# EAGLE design RGB_ADDR_THRU (EAGLE 7.2.0)
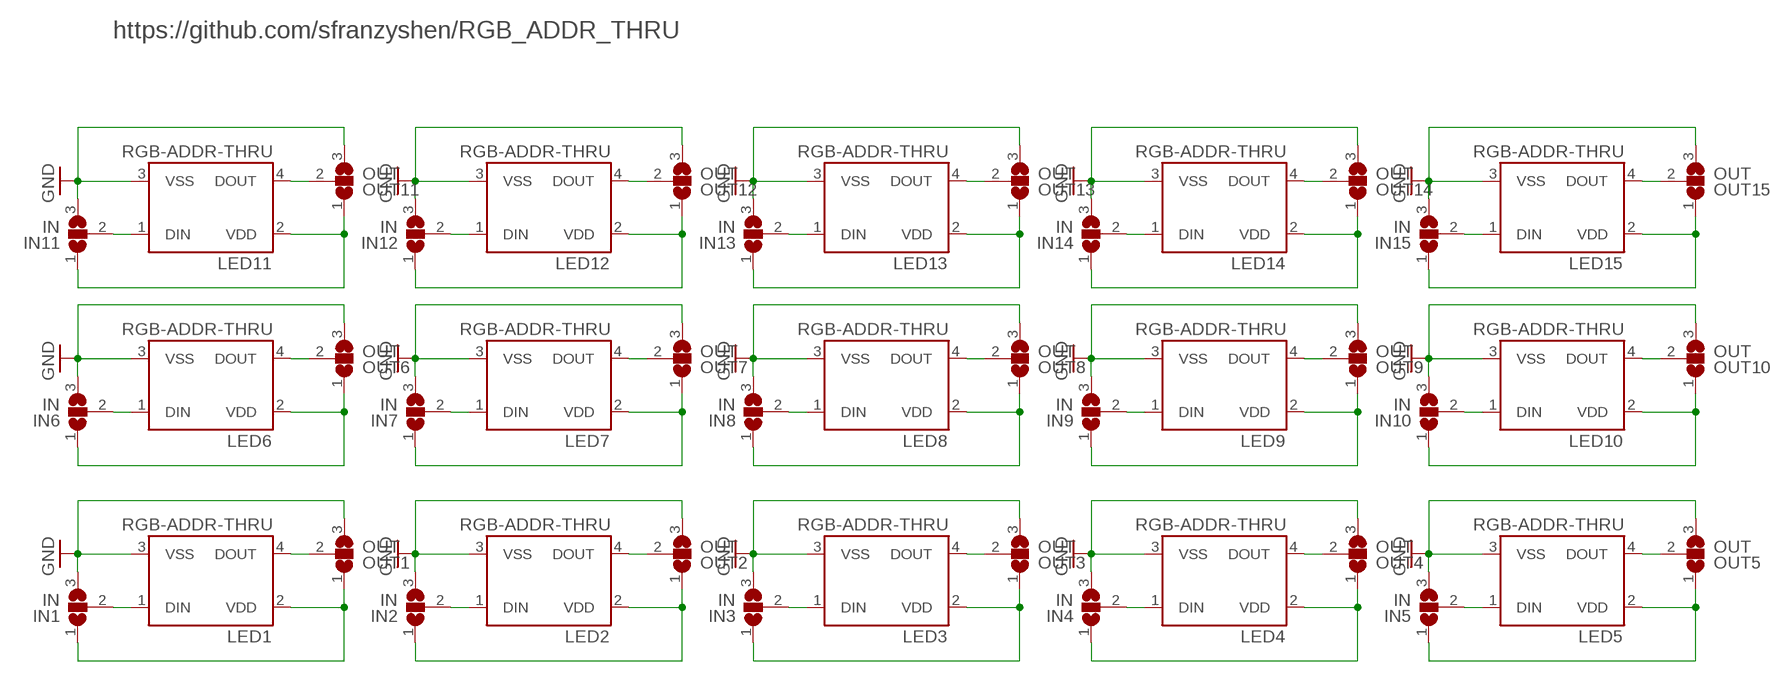
[diagram p0: schematic, sheet 1]

## Parts
IN1  IN  SJ2WW  [SJ_2W]
IN2  IN  SJ2WW  [SJ_2W]
IN3  IN  SJ2WW  [SJ_2W]
IN4  IN  SJ2WW  [SJ_2W]
IN5  IN  SJ2WW  [SJ_2W]
IN6  IN  SJ2WW  [SJ_2W]
IN7  IN  SJ2WW  [SJ_2W]
IN8  IN  SJ2WW  [SJ_2W]
IN9  IN  SJ2WW  [SJ_2W]
IN10  IN  SJ2WW  [SJ_2W]
IN11  IN  SJ2WW  [SJ_2W]
IN12  IN  SJ2WW  [SJ_2W]
IN13  IN  SJ2WW  [SJ_2W]
IN14  IN  SJ2WW  [SJ_2W]
IN15  IN  SJ2WW  [SJ_2W]
LED1  RGB-ADDR-THRU  LED-RGB-ADDR-THRU5MM  [LED-RGB-THRU]
LED2  RGB-ADDR-THRU  LED-RGB-ADDR-THRU5MM  [LED-RGB-THRU]
LED3  RGB-ADDR-THRU  LED-RGB-ADDR-THRU5MM  [LED-RGB-THRU]
LED4  RGB-ADDR-THRU  LED-RGB-ADDR-THRU5MM  [LED-RGB-THRU]
LED5  RGB-ADDR-THRU  LED-RGB-ADDR-THRU5MM  [LED-RGB-THRU]
LED6  RGB-ADDR-THRU  LED-RGB-ADDR-THRU5MM  [LED-RGB-THRU]
LED7  RGB-ADDR-THRU  LED-RGB-ADDR-THRU5MM  [LED-RGB-THRU]
LED8  RGB-ADDR-THRU  LED-RGB-ADDR-THRU5MM  [LED-RGB-THRU]
LED9  RGB-ADDR-THRU  LED-RGB-ADDR-THRU5MM  [LED-RGB-THRU]
LED10  RGB-ADDR-THRU  LED-RGB-ADDR-THRU5MM  [LED-RGB-THRU]
LED11  RGB-ADDR-THRU  LED-RGB-ADDR-THRU5MM  [LED-RGB-THRU]
LED12  RGB-ADDR-THRU  LED-RGB-ADDR-THRU5MM  [LED-RGB-THRU]
LED13  RGB-ADDR-THRU  LED-RGB-ADDR-THRU5MM  [LED-RGB-THRU]
LED14  RGB-ADDR-THRU  LED-RGB-ADDR-THRU5MM  [LED-RGB-THRU]
LED15  RGB-ADDR-THRU  LED-RGB-ADDR-THRU5MM  [LED-RGB-THRU]
OUT1  OUT  SJ2WW  [SJ_2W]
OUT2  OUT  SJ2WW  [SJ_2W]
OUT3  OUT  SJ2WW  [SJ_2W]
OUT4  OUT  SJ2WW  [SJ_2W]
OUT5  OUT  SJ2WW  [SJ_2W]
OUT6  OUT  SJ2WW  [SJ_2W]
OUT7  OUT  SJ2WW  [SJ_2W]
OUT8  OUT  SJ2WW  [SJ_2W]
OUT9  OUT  SJ2WW  [SJ_2W]
OUT10  OUT  SJ2WW  [SJ_2W]
OUT11  OUT  SJ2WW  [SJ_2W]
OUT12  OUT  SJ2WW  [SJ_2W]
OUT13  OUT  SJ2WW  [SJ_2W]
OUT14  OUT  SJ2WW  [SJ_2W]
OUT15  OUT  SJ2WW  [SJ_2W]

## Nets
GND: IN1.3 IN2.3 IN3.3 IN4.3 IN5.3 IN6.3 IN7.3 IN8.3 IN9.3 IN10.3 IN11.3 IN12.3 IN13.3 IN14.3 IN15.3 LED1.3(VSS) LED2.3(VSS) LED3.3(VSS) LED4.3(VSS) LED5.3(VSS) LED6.3(VSS) LED7.3(VSS) LED8.3(VSS) LED9.3(VSS) LED10.3(VSS) LED11.3(VSS) LED12.3(VSS) LED13.3(VSS) LED14.3(VSS) LED15.3(VSS) OUT1.3 OUT2.3 OUT3.3 OUT4.3 OUT5.3 OUT6.3 OUT7.3 OUT8.3 OUT9.3 OUT10.3 OUT11.3 OUT12.3 OUT13.3 OUT14.3 OUT15.3
N$2: IN1.2 LED1.1(DIN)
N$3: IN1.1 LED1.2(VDD) OUT1.1
N$4: LED1.4(DOUT) OUT1.2
N$6: IN2.2 LED2.1(DIN)
N$7: IN2.1 LED2.2(VDD) OUT2.1
N$8: LED2.4(DOUT) OUT2.2
N$10: IN7.2 LED7.1(DIN)
N$11: IN7.1 LED7.2(VDD) OUT7.1
N$12: LED7.4(DOUT) OUT7.2
N$14: IN8.2 LED8.1(DIN)
N$15: IN8.1 LED8.2(VDD) OUT8.1
N$16: LED8.4(DOUT) OUT8.2
N$18: IN9.2 LED9.1(DIN)
N$19: IN9.1 LED9.2(VDD) OUT9.1
N$20: LED9.4(DOUT) OUT9.2
N$22: IN3.2 LED3.1(DIN)
N$23: IN3.1 LED3.2(VDD) OUT3.1
N$24: LED3.4(DOUT) OUT3.2
N$26: IN10.2 LED10.1(DIN)
N$27: IN10.1 LED10.2(VDD) OUT10.1
N$28: LED10.4(DOUT) OUT10.2
N$30: IN4.2 LED4.1(DIN)
N$31: IN4.1 LED4.2(VDD) OUT4.1
N$32: LED4.4(DOUT) OUT4.2
N$34: IN5.2 LED5.1(DIN)
N$35: IN5.1 LED5.2(VDD) OUT5.1
N$36: LED5.4(DOUT) OUT5.2
N$38: IN6.2 LED6.1(DIN)
N$39: IN6.1 LED6.2(VDD) OUT6.1
N$40: LED6.4(DOUT) OUT6.2
N$42: IN11.2 LED11.1(DIN)
N$43: IN11.1 LED11.2(VDD) OUT11.1
N$44: LED11.4(DOUT) OUT11.2
N$46: IN12.2 LED12.1(DIN)
N$47: IN12.1 LED12.2(VDD) OUT12.1
N$48: LED12.4(DOUT) OUT12.2
N$50: IN13.2 LED13.1(DIN)
N$51: IN13.1 LED13.2(VDD) OUT13.1
N$52: LED13.4(DOUT) OUT13.2
N$54: IN14.2 LED14.1(DIN)
N$55: IN14.1 LED14.2(VDD) OUT14.1
N$56: LED14.4(DOUT) OUT14.2
N$58: IN15.2 LED15.1(DIN)
N$59: IN15.1 LED15.2(VDD) OUT15.1
N$60: LED15.4(DOUT) OUT15.2

## Notes on the sheet
- https://github.com/sfranzyshen/RGB_ADDR_THRU

## Library data of the parts
IN1-IN15 OUT1-OUT15 = jumper:SJ2W: SMD solder JUMPER
LED1-LED15 = SparkFun-LED:LED-RGB-ADDR-THRU: RGB Addressable Through-hole SparkFun store front COM-12986 5mm (diffuse) COM-12999 5mm (clear) COM-12877 8mm (diffuse)

## Board
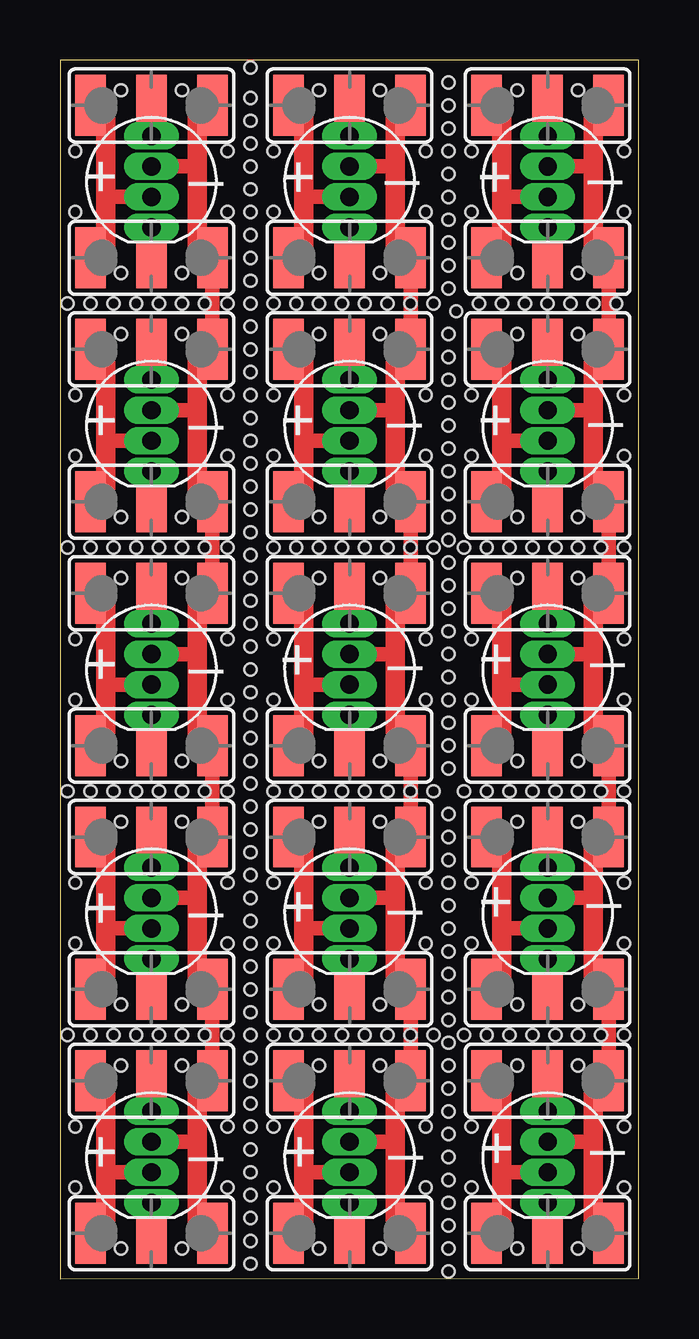
[diagram p1: board, top side]
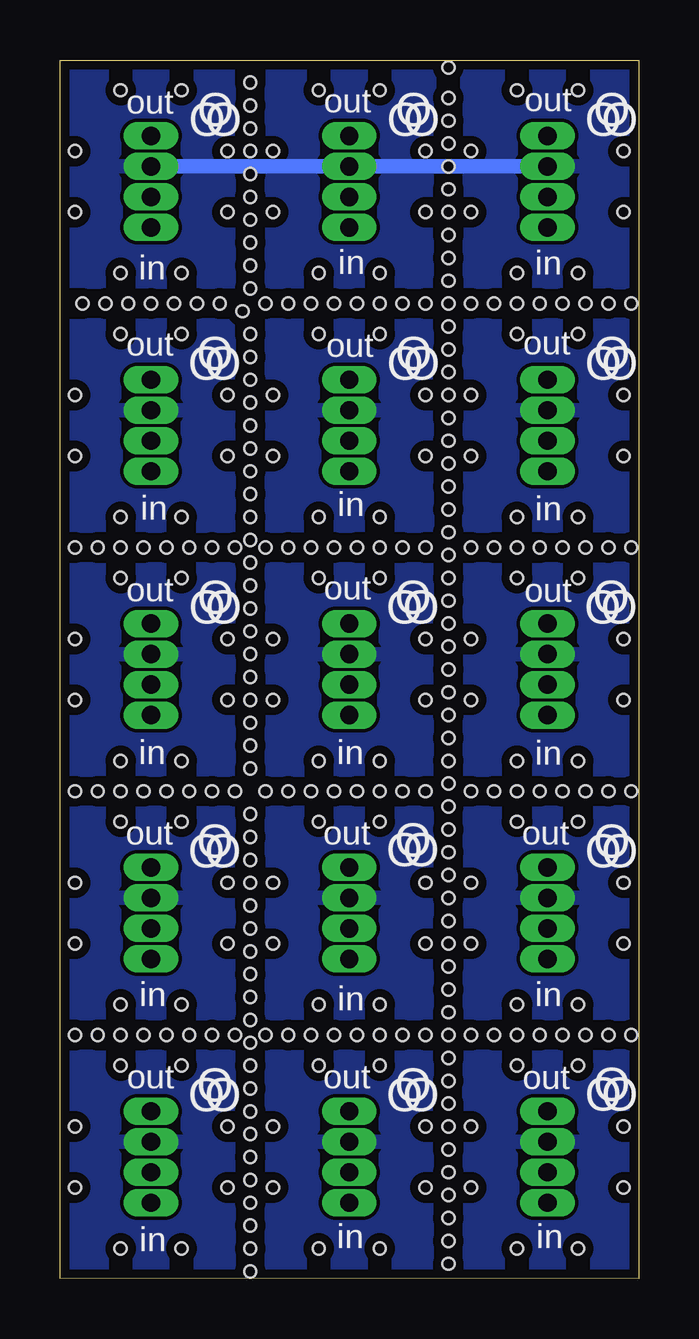
[diagram p2: board, bottom side, seen from below]

Size 24.12 x 50.79 mm. Coordinates in mm from the lower left corner, seen from the top.
Outline: 0,0 24.12,0.03 24.12,50.79 0,50.79 0,0
Copper layers (1*16): Top 0.0356mm / dielectric 1.5011mm / Bottom 0.0356mm
Design rules "LaenPCBOrder": minimum track width 6mil, minimum drill 13mil, track to track 6mil, track to pad 6mil, pad to pad 6mil, via to via 6mil, smd to smd 6mil, copper to edge 15mil, drill to drill 6mil, minimum pad ring 7mil, minimum via ring 7mil, stop-mask expansion 3mil, vias tented up to drill 0mil, thermal gap 10mil
Holes 0.5 mm at 2.54,1.27 5.08,1.27 5.08,8.89 2.54,8.89 0.64,6.35 6.99,6.35 0.64,3.81 6.99,3.81 2.54,19.05 5.08,19.05 2.54,11.43 5.08,11.43 6.99,13.97 6.99,16.51 0.64,16.51 0.64,13.97 2.54,29.21 5.08,29.21 2.54,49.53 5.08,49.53 0.64,26.67 6.99,26.67 6.99,24.13 0.64,24.13 2.54,21.59 5.08,21.59 2.54,41.91 5.08,41.91 6.99,44.45 6.99,46.99 0.64,46.99 0.64,44.45 2.54,39.37 5.08,39.37 2.54,31.75 5.08,31.75 0.64,34.29 0.64,36.83 6.99,36.83 6.99,34.29 10.79,8.89 13.34,8.89 15.24,6.35 15.24,3.81 13.34,1.27 10.79,1.27 8.89,3.81 8.89,6.35 8.89,16.51 10.79,19.05 13.34,19.05 15.24,16.51 15.24,13.97 8.89,13.97 10.79,11.43 13.34,11.43 10.79,21.59 13.34,21.59 8.89,24.13 8.89,26.67 15.24,26.67 15.24,24.13 10.79,29.21 13.34,29.21 10.79,31.75 13.34,31.75 15.24,34.29 8.89,34.29 8.89,36.83 15.24,36.83 13.34,39.37 10.79,39.37 13.34,41.91 10.79,41.91 8.89,44.45 8.89,46.99 15.24,46.99 10.79,49.53 13.34,49.53 15.24,44.45 19.05,1.27 21.59,1.27 23.5,3.81 17.14,3.81 17.14,6.35 23.5,6.35 19.05,8.89 21.59,8.89 19.05,11.43 21.59,11.43 23.5,13.97 17.14,13.97 17.14,16.51 23.5,16.51 19.05,19.05 21.59,19.05 19.05,21.59 21.59,21.59 23.5,24.13 17.14,24.13 17.14,26.67 23.5,26.67 21.59,29.21 19.05,29.21 21.59,31.75 19.05,31.75 17.14,34.29 17.14,36.83 23.5,36.83 23.5,34.29 21.59,39.37 19.05,39.37 21.59,41.91 19.05,41.91 17.14,44.45 17.14,46.99 23.5,46.99 23.5,44.45 21.59,49.53 19.05,49.53 2.22,10.16 3.17,10.16 4.13,10.16 5.08,10.16 6.03,10.16 6.99,10.16 7.94,8.26 7.94,7.3 7.94,6.35 7.94,5.4 7.94,4.45 7.94,3.49 7.94,2.54 7.94,1.59 7.94,17.78 7.94,16.83 7.94,15.88 7.94,14.92 7.94,13.97 7.94,13.02 7.94,12.06 7.94,11.11 2.22,20.32 3.17,20.32 4.13,20.32 5.08,20.32 6.03,20.32 6.99,20.32 7.94,28.26 7.94,27.3 7.94,26.35 7.94,25.4 7.94,24.45 7.94,23.5 7.94,22.54 7.94,21.59 7.94,37.78 7.94,36.83 7.94,35.88 7.94,34.92 7.94,33.97 7.94,33.02 7.94,32.07 7.94,31.11 7.94,48.26 7.94,47.31 7.94,46.35 7.94,45.4 7.94,44.45 7.94,43.5 7.94,42.55 7.94,41.59 0.32,30.48 1.27,30.48 2.22,30.48 3.17,30.48 4.13,30.48 5.08,30.48 0.32,40.64 1.27,40.64 2.22,40.64 3.17,40.64 4.13,40.64 5.08,40.64 7.94,9.21 7.94,10.16 1.27,10.16 0.32,10.16 7.94,18.73 7.94,19.68 7.94,20.64 1.27,20.32 0.32,20.32 6.03,30.48 6.99,30.48 7.94,30.16 7.94,29.21 6.03,40.64 6.99,40.64 7.94,40.64 7.94,38.73 7.94,39.69 7.94,49.21 7.94,50.48 10.79,10.16 11.75,10.16 12.7,10.16 13.65,10.16 14.61,10.16 9.84,10.16 8.89,10.16 10.79,20.32 11.75,20.32 12.7,20.32 13.65,20.32 14.61,20.32 9.84,20.32 8.89,20.32 10.79,30.48 11.75,30.48 12.7,30.48 13.65,30.48 14.61,30.48 9.84,30.48 8.89,30.48 10.79,40.64 11.75,40.64 12.7,40.64 13.65,40.64 14.61,40.64 9.84,40.64 8.89,40.64 16.19,0.32 16.19,1.27 16.19,2.22 16.19,3.17 16.19,4.13 16.19,5.08 16.19,6.03 16.19,6.99 16.19,7.94 16.19,8.89 16.19,9.84 16.19,10.79 16.19,11.75 15.56,10.16 16.83,10.16 17.78,10.16 18.73,10.16 19.68,10.16 20.64,10.16 21.59,10.16 22.54,10.16 23.5,10.16 16.19,12.7 16.19,13.65 16.19,14.61 16.19,15.56 16.19,16.51 16.19,17.46 16.19,18.41 16.19,19.37 15.56,20.32 16.83,20.32 17.78,20.32 18.73,20.32 19.68,20.32 20.64,20.32 21.59,20.32 22.54,20.32 23.5,20.32 16.19,21.27 16.19,22.23 16.19,23.18 16.19,24.13 16.19,25.08 16.19,26.04 16.19,26.99 16.19,27.94 16.19,28.89 16.19,29.84 16.19,30.8 16.19,31.75 15.56,30.48 16.83,30.48 17.78,30.48 18.73,30.48 19.68,30.48 20.64,30.48 21.59,30.48 22.54,30.48 23.5,30.48 15.56,40.64 16.51,40.32 17.46,40.64 18.41,40.64 19.37,40.64 20.32,40.64 21.27,40.64 22.23,40.64 23.18,40.64 16.19,32.7 16.19,33.66 16.19,34.61 16.19,35.56 16.19,36.51 16.19,37.47 16.19,38.42 16.19,39.37 16.19,41.27 16.19,42.23 16.19,43.18 16.19,44.13 16.19,45.09 16.19,46.04 16.19,46.99 16.19,47.94 16.19,48.9 16.19,49.85 7.94,0.64

### Footprints (pad centres in the part's own frame; a part is rotated, then mirrored left to right if it is on the bottom)
SJ_2W = smd 1.27 x 2.54: 1 -2.54,0; 2 0,0; 3 2.54,0
LED-RGB-THRU = drill 0.762 pad 0.889 long: 1 1.905,0; 2 0.635,0; 3 -0.635,0; 4 -1.905,0

### Placement (x,y rotation side)
IN1  3.81,1.91 0 top
IN2  3.81,12.06 0 top
IN3  3.81,22.23 0 top
IN4  3.81,32.38 0 top
IN5  3.81,42.55 0 top
IN6  12.06,1.91 0 top
IN7  12.06,12.06 0 top
IN8  12.06,22.23 0 top
IN9  12.06,32.38 0 top
IN10  12.06,42.55 0 top
IN11  20.32,1.91 0 top
IN12  20.32,12.06 0 top
IN13  20.32,22.23 0 top
IN14  20.32,32.38 0 top
IN15  20.32,42.55 0 top
LED1  3.81,5.08 270 top
LED2  3.81,15.24 270 top
LED3  3.81,25.4 270 top
LED4  3.81,35.56 270 top
LED5  3.81,45.72 270 top
LED6  12.06,5.08 270 top
LED7  12.06,15.24 270 top
LED8  12.06,25.4 270 top
LED9  12.06,35.56 270 top
LED10  12.06,45.72 270 top
LED11  20.32,5.08 270 top
LED12  20.32,15.24 270 top
LED13  20.32,25.4 270 top
LED14  20.32,35.56 270 top
LED15  20.32,45.72 270 top
OUT1  3.81,8.26 0 top
OUT2  3.81,18.41 0 top
OUT3  3.81,28.57 0 top
OUT4  3.81,38.73 0 top
OUT5  3.81,48.9 0 top
OUT6  12.06,8.26 0 top
OUT7  12.06,18.41 0 top
OUT8  12.06,28.57 0 top
OUT9  12.06,38.73 0 top
OUT10  12.06,48.9 0 top
OUT11  20.32,8.26 0 top
OUT12  20.32,18.41 0 top
OUT13  20.32,28.57 0 top
OUT14  20.32,38.73 0 top
OUT15  20.32,48.9 0 top

### Tracks (layer width: path | path; a pad name or v marks a point on that pad's centre or on a via)
GND
  Top 0.61: LED1.3 5.71,5.71 | OUT1.3 IN2.3 | LED2.3 5.71,15.88 | OUT2.3 IN3.3 | LED3.3 5.71,26.04 | OUT3.3 IN4.3 | LED4.3 5.71,36.2 | OUT4.3 IN5.3 | LED5.3 5.71,46.35 | LED6.3 13.97,5.71 | OUT6.3 IN7.3 | LED7.3 13.97,15.88 | OUT7.3 IN8.3 | LED8.3 13.97,26.04 | OUT8.3 IN9.3 | LED9.3 13.97,36.2 | OUT9.3 IN10.3 | LED10.3 13.97,46.35 | LED11.3 22.23,5.71 | OUT11.3 IN12.3 | LED12.3 22.23,15.88 | OUT12.3 IN13.3 | LED13.3 22.23,26.04 | OUT13.3 IN14.3 | LED14.3 22.23,36.2 | OUT14.3 IN15.3 | LED15.3 22.23,46.35
  Top 0.813: IN1.3 arc-90 5.71,2.54 5.71,5.71 5.71,7.62 arc-90 OUT1.3 | IN2.3 arc-90 5.71,12.7 5.71,15.88 5.71,17.78 arc-90 OUT2.3 | IN3.3 arc-90 5.71,22.86 5.71,26.04 5.71,27.94 arc-90 OUT3.3 | IN4.3 arc-90 5.71,33.02 5.71,36.2 5.71,38.1 arc-90 OUT4.3 | IN5.3 arc-90 5.71,43.18 5.71,46.35 5.71,48.26 arc-90 OUT5.3 | IN6.3 arc-90 13.97,2.54 13.97,5.71 13.97,7.62 arc-90 OUT6.3 | IN7.3 arc-90 13.97,12.7 13.97,15.88 13.97,17.78 arc-90 OUT7.3 | IN8.3 arc-90 13.97,22.86 13.97,26.04 13.97,27.94 arc-90 OUT8.3 | IN9.3 arc-90 13.97,33.02 13.97,36.2 13.97,38.1 arc-90 OUT9.3 | IN10.3 arc-90 13.97,43.18 13.97,46.35 13.97,48.26 arc-90 OUT10.3 | IN11.3 arc-90 22.23,2.54 22.23,5.71 22.23,7.62 arc-90 OUT11.3 | IN12.3 arc-90 22.23,12.7 22.23,15.88 22.23,17.78 arc-90 OUT12.3 | IN13.3 arc-90 22.23,22.86 22.23,26.04 22.23,27.94 arc-90 OUT13.3 | IN14.3 arc-90 22.23,33.02 22.23,36.2 22.23,38.1 arc-90 OUT14.3 | IN15.3 arc-90 22.23,43.18 22.23,46.35 22.23,48.26 arc-90 OUT15.3
  Bottom 0.61: LED15.3 LED10.3 LED5.3
  pour Bottom: -0.64,51.44 24.78,51.44 24.78,-0.64 -0.64,-0.64
N$2
  Top 0.61: LED1.1 IN1.2
N$3
  Top 0.61: LED1.2 1.91,4.45
  Top 0.813: IN1.1 arc90 1.91,2.54 1.91,4.45 1.91,7.62 arc90 OUT1.1
N$4
  Top 0.61: LED1.4 OUT1.2
N$6
  Top 0.61: LED2.1 IN2.2
N$7
  Top 0.61: LED2.2 1.91,14.61
  Top 0.813: IN2.1 arc90 1.91,12.7 1.91,14.61 1.91,17.78 arc90 OUT2.1
N$8
  Top 0.61: LED2.4 OUT2.2
N$10
  Top 0.813: LED7.1 IN7.2
N$11
  Top 0.61: LED7.2 10.16,14.61
  Top 0.813: IN7.1 arc90 10.16,12.7 10.16,14.61 10.16,17.78 arc90 OUT7.1
N$12
  Top 0.813: LED7.4 OUT7.2
N$14
  Top 0.813: LED8.1 IN8.2
N$15
  Top 0.61: LED8.2 10.16,24.77
  Top 0.813: IN8.1 arc90 10.16,22.86 10.16,24.77 10.16,27.94 arc90 OUT8.1
N$16
  Top 0.813: LED8.4 OUT8.2
N$18
  Top 0.813: LED9.1 IN9.2
N$19
  Top 0.61: LED9.2 10.16,34.92
  Top 0.813: IN9.1 arc90 10.16,33.02 10.16,34.92 10.16,38.1 arc90 OUT9.1
N$20
  Top 0.813: LED9.4 OUT9.2
N$22
  Top 0.61: LED3.1 IN3.2
N$23
  Top 0.61: LED3.2 1.91,24.77
  Top 0.813: IN3.1 arc90 1.91,22.86 1.91,24.77 1.91,27.94 arc90 OUT3.1
N$24
  Top 0.61: LED3.4 OUT3.2
N$26
  Top 0.813: LED10.1 IN10.2
N$27
  Top 0.61: LED10.2 10.16,45.09
  Top 0.813: IN10.1 arc90 10.16,43.18 10.16,45.09 10.16,48.26 arc90 OUT10.1
N$28
  Top 0.813: LED10.4 OUT10.2
N$30
  Top 0.61: LED4.1 IN4.2
N$31
  Top 0.61: LED4.2 1.91,34.92
  Top 0.813: IN4.1 arc90 1.91,33.02 1.91,34.92 1.91,38.1 arc90 OUT4.1
N$32
  Top 0.61: LED4.4 OUT4.2
N$34
  Top 0.61: LED5.1 IN5.2
N$35
  Top 0.61: LED5.2 2.22,45.09 arc90 1.91,44.77
  Top 0.813: IN5.1 arc90 1.91,43.18 1.91,44.77 1.91,48.26 arc90 OUT5.1
N$36
  Top 0.61: LED5.4 OUT5.2
N$38
  Top 0.61: LED6.1 IN6.2
N$39
  Top 0.61: LED6.2 10.16,4.45
  Top 0.813: IN6.1 arc90 10.16,2.54 10.16,4.45 10.16,7.62 arc90 OUT6.1
N$40
  Top 0.61: LED6.4 OUT6.2
N$42
  Top 0.813: LED11.1 IN11.2
N$43
  Top 0.61: LED11.2 18.41,4.45
  Top 0.813: IN11.1 arc90 18.41,2.54 18.41,4.45 18.41,7.62 arc90 OUT11.1
N$44
  Top 0.813: LED11.4 OUT11.2
N$46
  Top 0.813: LED12.1 IN12.2
N$47
  Top 0.61: LED12.2 18.41,14.61 18.41,14.29
  Top 0.813: OUT12.1 arc-90 18.41,17.78 18.41,14.29 18.41,12.7 arc-90 IN12.1
N$48
  Top 0.813: LED12.4 OUT12.2
N$50
  Top 0.61: IN13.2 LED13.1
N$51
  Top 0.61: LED13.2 18.41,24.77
  Top 0.813: OUT13.1 arc-90 18.41,27.94 18.41,24.77 18.41,22.86 arc-90 IN13.1
N$52
  Top 0.813: LED13.4 OUT13.2
N$54
  Top 0.813: LED14.1 IN14.2
N$55
  Top 0.61: LED14.2 18.41,34.92 18.41,34.61
  Top 0.813: IN14.1 arc90 18.41,33.02 18.41,34.61 18.41,38.1 arc90 OUT14.1
N$56
  Top 0.813: LED14.4 OUT14.2
N$58
  Top 0.813: LED15.1 IN15.2
N$59
  Top 0.61: LED15.2 18.41,45.09
  Top 0.813: IN15.1 arc90 18.41,43.18 18.41,45.09 18.41,48.26 arc90 OUT15.1
N$60
  Top 0.813: LED15.4 OUT15.2

### Text on the board
tPlace: _ | _ | _ | + | + | + | _ | _ | _ | + | + | + | _ | _ | _ | + | + | + | _ | _ | _ | + | + | + | _ | _ | _ | + | + | +
bPlace: out | out | out | in | in | in | out | out | out | in | in | in | out | out | out | in | in | in | out | out | out | in | in | in | out | out | out | in | in | in
bNames: O | O | O | O | O | O | O | O | O | O | O | O | O | O | O | O | O | O | O | O | O | O | O | O | O | O | O | O | O | O | O | O | O | O | O | O | O | O | O | O | O | O | O | O | O